# Altium schematic sheet Current SENSOR.SchDoc
size Letter; SheetNumber: 20; SheetTotal: 22
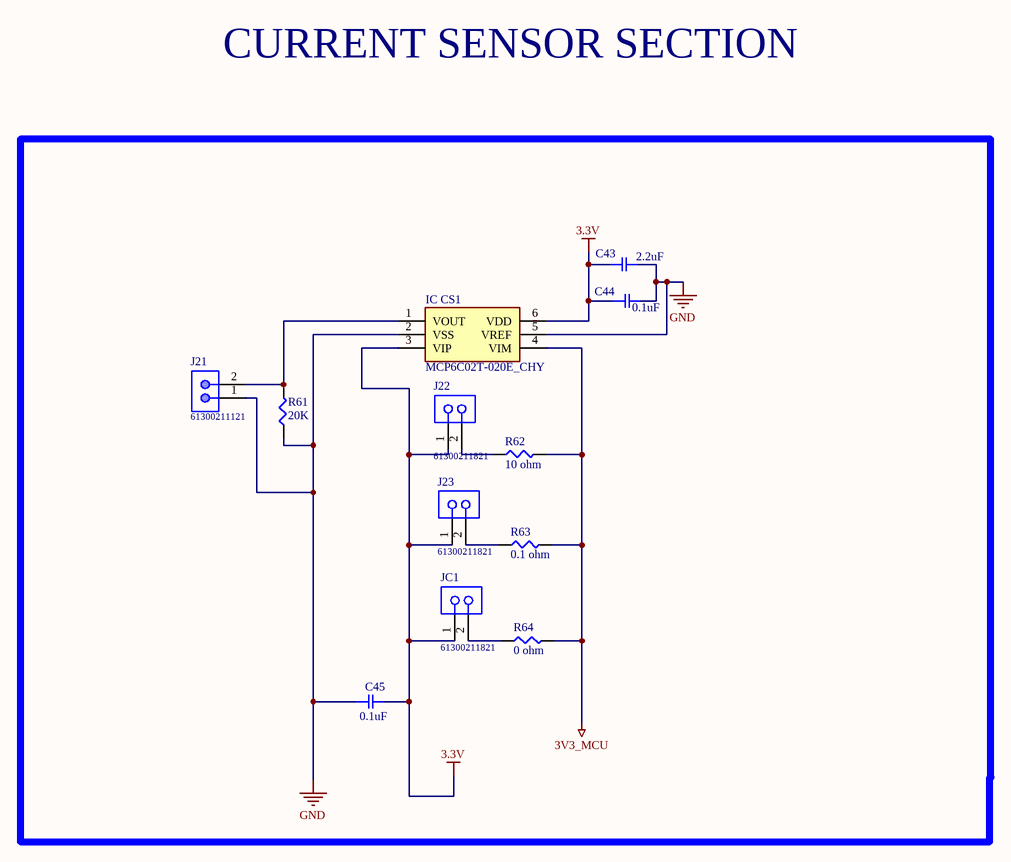
[diagram p0: Current SENSOR.SchDoc]

## Parts
C43  2.2uF  [SMD-0805C]
C44  0.1uF  [SMD-0805C]
C45  0.1uF  [SMD-0805C]
IC_CS1  MCP6C02T-020E_CHY  [SOT95P280X145-6N]
J21  61300211121  [61300211121]
J22  61300211821  [61300211821]
J23  61300211821  [61300211821]
JC1  61300211821  [61300211821]
R61  20K  [SMD-0805-RES]
R62  10 ohm  [SMD-1206-RES]
R63  0.1 ohm  [SMD-0805-RES]
R64  0 ohm  [SMD-1206-RES]

## Nets
3.3V: C43.1 C44.1 C45.2 IC_CS1.3(VIP) IC_CS1.6(VDD) J22.1 J23.1 JC1.1
3V3_MCU: IC_CS1.4(VIM) R62.2 R63.2 R64.2
GND: C43.2 C44.2 C45.1 IC_CS1.2(VSS) IC_CS1.5(VREF) J21.1 R61.1
NetIC_CS1_1: IC_CS1.1(VOUT) J21.2 R61.2
NetJ22_2: J22.2 R62.1
NetJ23_2: J23.2 R63.1
NetJC1_2: JC1.2 R64.1

## Notes on the sheet
- CURRENT SENSOR SECTION

## Library data of the parts
C43-C45 = GCD21BR71H104KA01L: CAP CER 0.1UF 50V X7R 0805; Manufacturer: Murata Electronics North America; Factory Stock: 0; Unit Price (USD): 0.24; Minimum Quantity: 1; Value: 0.10µF; Tolerance: ±10%; Datasheets: http://www.murata.com/~/media/webrenewal/support/library/catalog/products/capacitor/mlcc/c03e.ashx; Image: //media.digikey.com/Renders/Murata%20Renders/0805%28GxM6%29.jpg; Digi-Key Part Number: 490-11955-1-ND; Part Number: GCD21BR71H104KA01L; Quantity Available: 157; @ qty: 0; Packaging: Cut Tape (CT); Series: GCD; Part Status: Active; Voltage: 50V; Temperature Coefficient: X7R; Operating Temperature: -55°C ~ 125°C; Features: -; Ratings: AEC-Q200; Applications: Automotive; Mounting Type: Surface Mount, MLCC; Package / Case: 0805 (2012 Metric); Size / Dimension: 0.079" L x 0.049" W (2.00mm x 1.25mm); Height - Seated (Max): -; Thickness (Max): 0.049" (1.25mm); Lead Spacing: -; Lead Style: -
IC_CS1 = MCP6C02T-020E_CHY: Integrated Circuit; Manufacturer_Name: Microchip; Manufacturer_Part_Number: MCP6C02T-020E/CHY; Datasheet Link: https://www.arrow.com/en/products/mcp6c02t-020echy/microchip-technology; Height: 1.45mm; Mouser Part Number: 579-MCP6C02T020ECHY; Mouser Price/Stock: https://www.mouser.co.uk/ProductDetail/Microchip-Technology/MCP6C02T-020E-CHY?qs=PqoDHHvF64%2FP1agGSWWLsQ%3D%3D; Arrow Part Number: MCP6C02T-020E/CHY; Arrow Price/Stock: https://www.arrow.com/en/products/mcp6c02t-020echy/microchip-technology?region=nac
J21 = 61300211121: WR-PHD Pin Header, THT, pitch 2.54mm, Single Row, Vertical, 2pin; Pin Number: 2; Gender: Male; Rated Current: 3A; Working Voltage: 250VAC; Withstanding Voltage: 500VAC; Contact Resistance: 20mOhm; ComponentLink1Description: Manufacturer; ComponentLink1URL: http://www.we-online.de; ComponentLink2Description: Datasheet; ComponentLink2URL: https://katalog.we-online.de/em/datasheet/6130xx11121.pdf; Part Number: 61300211121; Published Date: June 2019; Publisher: Wurth Elektronik; Pitch: 2.54mm; Operating Temperature: -40 to +105degC; Mounting Technology: THT; Packaging: Bag; Row Number: Single; Orientation: Vertical
J22 J23 JC1 = 61300211821: WR-PHD Socket Header, THT, pitch 2.54mm, Single Row, Vertical, 2pin; Pin Number: 2; Gender: Female; Rated Current: 3A; Working Voltage: 250VAC; Withstanding Voltage: 500VAC; Contact Resistance: 20mOhm; ComponentLink1Description: Manufacturer; ComponentLink1URL: http://www.we-online.de; ComponentLink2Description: Datasheet; ComponentLink2URL: https://katalog.we-online.de/em/datasheet/6130xx11821.pdf; Part Number: 61300211821; Published Date: June 2019; Publisher: Wurth Elektronik; Pitch: 2.54mm; Operating Temperature: -40 to +125degC; Mounting Technology: THT; Packaging: Tray; Row Number: Single; Orientation: Vertical
R61 = ERJ-P6WJ105V: RES SMD 1M OHM 5% 1/2W 0805; Manufacturer: Panasonic Electronic Components; Factory Stock: 0; Unit Price (USD): 0.08237; @ qty: 1500; Minimum Quantity: 1; Power (Watts): 0.5W, 1/2W; Temperature Coefficient: ±200ppm/°C; Part Number: ERJ-P6WJ105V; Datasheets: https://industrial.panasonic.com/cdbs/www-data/pdf/RDA0000/AOA0000C243.pdf; Image: //media.digikey.com/Renders/Panasonic%20Renders/ERJ-0805%20Pkg.jpg; Digi-Key Part Number: P16990CT-ND; Quantity Available: 3210; Packaging: Cut Tape (CT); Series: ERJ; Part Status: Active; Value: 1M; Tolerance: ±5%; Composition: Thick Film; Features: Automotive AEC-Q200, Pulse Withstanding; Operating Temperature: -55°C ~ 155°C; Package / Case: 0805 (2012 Metric); Supplier Device Package: 0805; Size / Dimension: 0.079" L x 0.049" W (2.00mm x 1.25mm); Height - Seated (Max): 0.030" (0.75mm); Number of Terminations: 2; Failure Rate: -
R62 R64 = ERJ-8BQFR22V: RES SMD 0.22 OHM 1% 1/2W 1206; Manufacturer: Panasonic Electronic Components; Factory Stock: 0; Unit Price (USD): 0.05778; @ qty: 1500; Minimum Quantity: 1; Value: 0.22; Power (Watts): 0.5W, 1/2W; Temperature Coefficient: ±250ppm/°C; Part Number: ERJ-8BQFR22V; Datasheets: https://industrial.panasonic.com/cdbs/www-data/pdf/RDA0000/AOA0000C239.pdf; Image: //media.digikey.com/Renders/Panasonic%20Renders/ERJ-1206%20Pkg.jpg; Digi-Key Part Number: P17624CT-ND; Quantity Available: 11511; Packaging: Cut Tape (CT); Series: ERJ; Part Status: Active; Tolerance: ±1%; Composition: Thick Film; Features: Automotive AEC-Q200, Current Sense; Operating Temperature: -55°C ~ 125°C; Package / Case: 1206 (3216 Metric); Supplier Device Package: 1206; Size / Dimension: 0.126" L x 0.063" W (3.20mm x 1.60mm); Height - Seated (Max): 0.028" (0.70mm); Number of Terminations: 2; Failure Rate: -
R63 = ERJ-S6SJR10V: RES SMD 0.1 OHM 5% 1/4W 0805; Manufacturer: Panasonic Electronic Components; Factory Stock: 0; Unit Price (USD): 0.07603; @ qty: 1500; Minimum Quantity: 1; Value: 0.1; Power (Watts): 0.25W, 1/4W; Temperature Coefficient: ±150ppm/°C; Part Number: ERJ-S6SJR10V; Datasheets: https://industrial.panasonic.com/cdbs/www-data/pdf/RDA0000/AOA0000CE5.pdf; Image: //media.digikey.com/Renders/Panasonic%20Renders/ERJ-0805%20Pkg.jpg; Digi-Key Part Number: P.1BKCT-ND; Quantity Available: 10102; Packaging: Cut Tape (CT); Series: ERJ; Part Status: Active; Tolerance: ±5%; Composition: Thick Film; Features: Anti-Sulfur, Automotive AEC-Q200; Operating Temperature: -55°C ~ 155°C; Package / Case: 0805 (2012 Metric); Supplier Device Package: 0805; Size / Dimension: 0.079" L x 0.049" W (2.00mm x 1.25mm); Height - Seated (Max): 0.026" (0.65mm); Number of Terminations: 2; Failure Rate: -